# Altium project testrack_carrier.PrjPcb
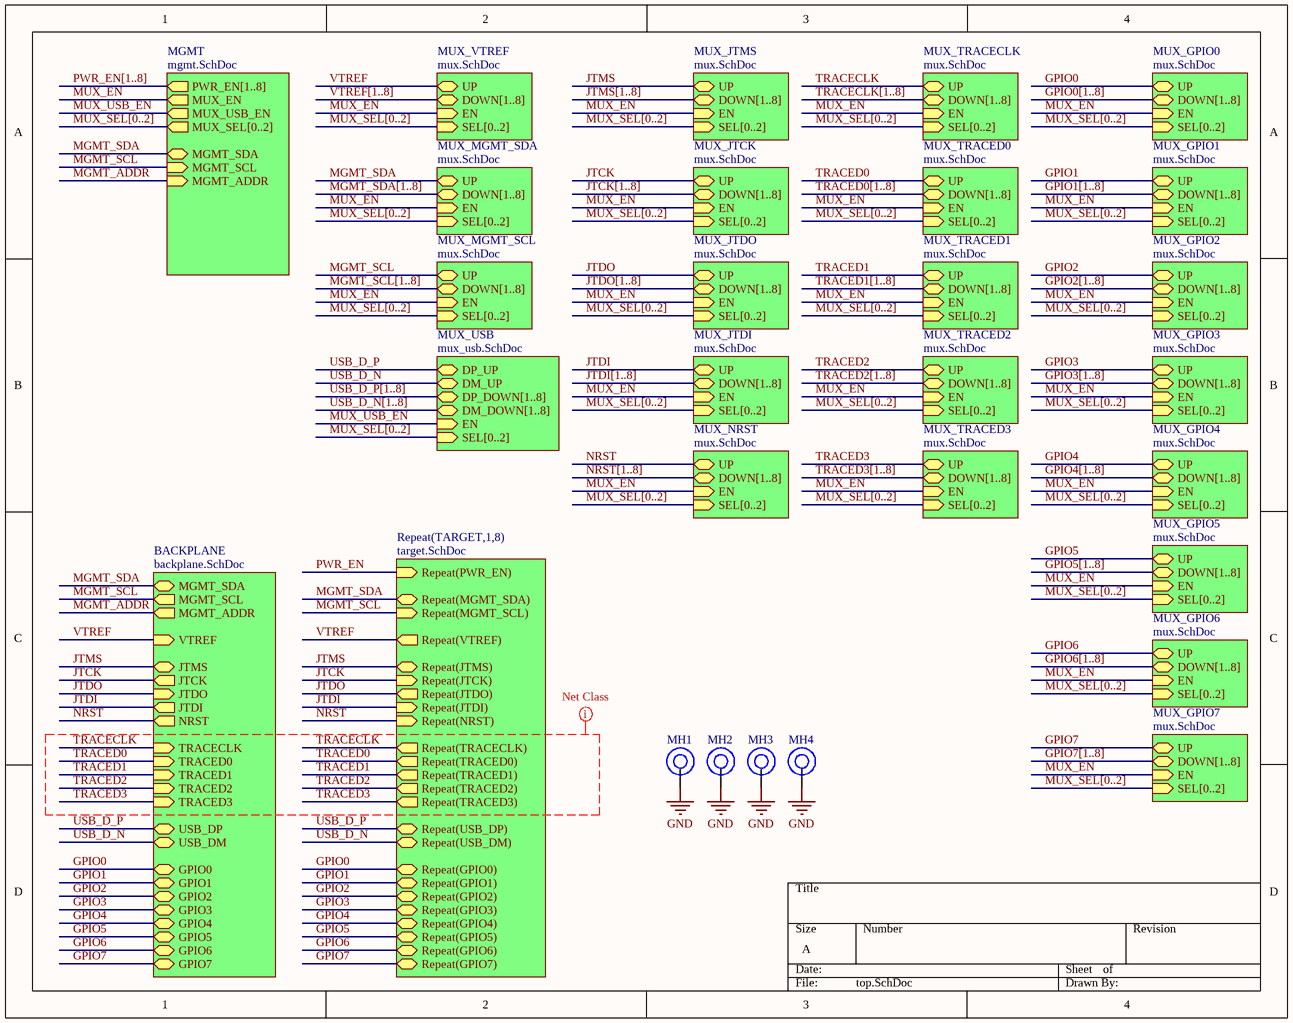
[diagram p0: top.SchDoc]
6 sheets, 115 parts. Net scope: hierarchical (ports join the sheet entries above them; power ports are global).
Board file: testrack_carrier.PcbDoc
Sheets:
  top.SchDoc
    TARGET1 = target.SchDoc
    TARGET2 = target.SchDoc
    TARGET3 = target.SchDoc
    TARGET4 = target.SchDoc
    TARGET5 = target.SchDoc
    TARGET6 = target.SchDoc
    TARGET7 = target.SchDoc
    TARGET8 = target.SchDoc
    BACKPLANE = backplane.SchDoc
    MGMT = mgmt.SchDoc
    MUX_VTREF = mux.SchDoc
    MUX_JTMS = mux.SchDoc
    MUX_GPIO0 = mux.SchDoc
    MUX_GPIO1 = mux.SchDoc
    MUX_GPIO2 = mux.SchDoc
    MUX_GPIO3 = mux.SchDoc
    MUX_GPIO4 = mux.SchDoc
    MUX_GPIO5 = mux.SchDoc
    MUX_GPIO6 = mux.SchDoc
    MUX_GPIO7 = mux.SchDoc
    MUX_TRACECLK = mux.SchDoc
    MUX_TRACED0 = mux.SchDoc
    MUX_TRACED1 = mux.SchDoc
    MUX_TRACED2 = mux.SchDoc
    MUX_TRACED3 = mux.SchDoc
    MUX_JTCK = mux.SchDoc
    MUX_JTDO = mux.SchDoc
    MUX_JTDI = mux.SchDoc
    MUX_NRST = mux.SchDoc
    MUX_USB = mux_usb.SchDoc
    MUX_MGMT_SDA = mux.SchDoc
    MUX_MGMT_SCL = mux.SchDoc

## Sheet top.SchDoc
size A

### Parts
MH1  Mounting_Hole  [WA-SMSI_M2.5]  (value not drawn)
MH2  Mounting_Hole  [WA-SMSI_M2.5]  (value not drawn)
MH3  Mounting_Hole  [WA-SMSI_M2.5]  (value not drawn)
MH4  Mounting_Hole  [WA-SMSI_M2.5]  (value not drawn)

### Sub-sheets
BACKPLANE = backplane.SchDoc: JTCK (out), GPIO1 (bidir), GPIO0 (bidir), TRACED0 (in), GPIO6 (bidir), USB_DP (bidir), NRST (out), USB_DM (bidir), MGMT_SDA (bidir), GPIO5 (bidir), JTDO (in), GPIO7 (bidir), GPIO3 (bidir), VTREF (in), TRACED2 (in), GPIO2 (bidir), TRACECLK (in), GPIO4 (bidir), MGMT_SCL (out), JTMS (bidir), TRACED3 (in), TRACED1 (in), JTDI (out), MGMT_ADDR (out)
MGMT = mgmt.SchDoc: PWR_EN[1..8] (out), MUX_SEL[0..2] (out), MGMT_SDA (bidir), MGMT_SCL (in), MUX_EN (out), MGMT_ADDR (in), MUX_USB_EN (out)
MUX_GPIO0 = mux.SchDoc: SEL[0..2] (in), DOWN[1..8] (bidir), UP (bidir), EN (in)
MUX_GPIO1 = mux.SchDoc: SEL[0..2] (in), DOWN[1..8] (bidir), UP (bidir), EN (in)
MUX_GPIO2 = mux.SchDoc: SEL[0..2] (in), DOWN[1..8] (bidir), UP (bidir), EN (in)
MUX_GPIO3 = mux.SchDoc: SEL[0..2] (in), DOWN[1..8] (bidir), UP (bidir), EN (in)
MUX_GPIO4 = mux.SchDoc: SEL[0..2] (in), DOWN[1..8] (bidir), UP (bidir), EN (in)
MUX_GPIO5 = mux.SchDoc: SEL[0..2] (in), DOWN[1..8] (bidir), UP (bidir), EN (in)
MUX_GPIO6 = mux.SchDoc: SEL[0..2] (in), DOWN[1..8] (bidir), UP (bidir), EN (in)
MUX_GPIO7 = mux.SchDoc: SEL[0..2] (in), DOWN[1..8] (bidir), UP (bidir), EN (in)
MUX_JTCK = mux.SchDoc: SEL[0..2] (in), DOWN[1..8] (bidir), UP (bidir), EN (in)
MUX_JTDI = mux.SchDoc: SEL[0..2] (in), DOWN[1..8] (bidir), UP (bidir), EN (in)
MUX_JTDO = mux.SchDoc: SEL[0..2] (in), DOWN[1..8] (bidir), UP (bidir), EN (in)
MUX_JTMS = mux.SchDoc: SEL[0..2] (in), DOWN[1..8] (bidir), UP (bidir), EN (in)
MUX_MGMT_SCL = mux.SchDoc: SEL[0..2] (in), DOWN[1..8] (bidir), UP (bidir), EN (in)
MUX_MGMT_SDA = mux.SchDoc: SEL[0..2] (in), DOWN[1..8] (bidir), UP (bidir), EN (in)
MUX_NRST = mux.SchDoc: SEL[0..2] (in), DOWN[1..8] (bidir), UP (bidir), EN (in)
MUX_TRACECLK = mux.SchDoc: SEL[0..2] (in), DOWN[1..8] (bidir), UP (bidir), EN (in)
MUX_TRACED0 = mux.SchDoc: SEL[0..2] (in), DOWN[1..8] (bidir), UP (bidir), EN (in)
MUX_TRACED1 = mux.SchDoc: SEL[0..2] (in), DOWN[1..8] (bidir), UP (bidir), EN (in)
MUX_TRACED2 = mux.SchDoc: SEL[0..2] (in), DOWN[1..8] (bidir), UP (bidir), EN (in)
MUX_TRACED3 = mux.SchDoc: SEL[0..2] (in), DOWN[1..8] (bidir), UP (bidir), EN (in)
MUX_USB = mux_usb.SchDoc: SEL[0..2] (in), DP_UP (bidir), EN (in), DP_DOWN[1..8] (bidir), DM_UP (bidir), DM_DOWN[1..8] (bidir)
MUX_VTREF = mux.SchDoc: SEL[0..2] (in), DOWN[1..8] (bidir), UP (bidir), EN (in)
Repeat(TARGET,1,8) = target.SchDoc: Repeat(JTCK) (in), Repeat(GPIO1) (bidir), Repeat(GPIO0) (bidir), Repeat(TRACED0) (out), Repeat(GPIO6) (bidir), Repeat(USB_DP) (bidir), Repeat(NRST) (in), Repeat(USB_DM) (bidir), Repeat(MGMT_SDA) (bidir), Repeat(GPIO5) (bidir), Repeat(JTDO) (out), Repeat(GPIO7) (bidir), Repeat(GPIO3) (bidir), Repeat(VTREF) (out), Repeat(TRACED2) (out), Repeat(GPIO2) (bidir), Repeat(TRACECLK) (out), Repeat(GPIO4) (bidir), Repeat(MGMT_SCL) (in), Repeat(JTMS) (bidir), Repeat(TRACED3) (out), Repeat(TRACED1) (out), Repeat(JTDI) (in), Repeat(PWR_EN) (in)

### Nets
GND: MH1.1 MH2.1 MH3.1 MH4.1
GPIO0: sheet Repeat(TARGET,1,8)/Repeat(GPIO0), sheet BACKPLANE/GPIO0, sheet MUX_GPIO0/UP
GPIO1: sheet Repeat(TARGET,1,8)/Repeat(GPIO1), sheet BACKPLANE/GPIO1, sheet MUX_GPIO1/UP
GPIO2: sheet Repeat(TARGET,1,8)/Repeat(GPIO2), sheet BACKPLANE/GPIO2, sheet MUX_GPIO2/UP
GPIO3: sheet Repeat(TARGET,1,8)/Repeat(GPIO3), sheet BACKPLANE/GPIO3, sheet MUX_GPIO3/UP
GPIO4: sheet Repeat(TARGET,1,8)/Repeat(GPIO4), sheet BACKPLANE/GPIO4, sheet MUX_GPIO4/UP
GPIO5: sheet Repeat(TARGET,1,8)/Repeat(GPIO5), sheet BACKPLANE/GPIO5, sheet MUX_GPIO5/UP
GPIO6: sheet Repeat(TARGET,1,8)/Repeat(GPIO6), sheet BACKPLANE/GPIO6, sheet MUX_GPIO6/UP
GPIO7: sheet Repeat(TARGET,1,8)/Repeat(GPIO7), sheet BACKPLANE/GPIO7, sheet MUX_GPIO7/UP
JTCK: sheet Repeat(TARGET,1,8)/Repeat(JTCK), sheet BACKPLANE/JTCK, sheet MUX_JTCK/UP
JTDI: sheet Repeat(TARGET,1,8)/Repeat(JTDI), sheet BACKPLANE/JTDI, sheet MUX_JTDI/UP
JTDO: sheet Repeat(TARGET,1,8)/Repeat(JTDO), sheet BACKPLANE/JTDO, sheet MUX_JTDO/UP
JTMS: sheet Repeat(TARGET,1,8)/Repeat(JTMS), sheet BACKPLANE/JTMS, sheet MUX_JTMS/UP
MGMT_ADDR: sheet BACKPLANE/MGMT_ADDR, sheet MGMT/MGMT_ADDR
MGMT_SCL: sheet Repeat(TARGET,1,8)/Repeat(MGMT_SCL), sheet BACKPLANE/MGMT_SCL, sheet MGMT/MGMT_SCL, sheet MUX_MGMT_SCL/UP
MGMT_SDA: sheet Repeat(TARGET,1,8)/Repeat(MGMT_SDA), sheet BACKPLANE/MGMT_SDA, sheet MGMT/MGMT_SDA, sheet MUX_MGMT_SDA/UP
MUX_EN: sheet MGMT/MUX_EN, sheet MUX_VTREF/EN, sheet MUX_JTMS/EN, sheet MUX_GPIO0/EN, sheet MUX_GPIO1/EN, sheet MUX_GPIO2/EN, sheet MUX_GPIO3/EN, sheet MUX_GPIO4/EN, sheet MUX_GPIO5/EN, sheet MUX_GPIO6/EN, sheet MUX_GPIO7/EN, sheet MUX_TRACECLK/EN, sheet MUX_TRACED0/EN, sheet MUX_TRACED1/EN, sheet MUX_TRACED2/EN, sheet MUX_TRACED3/EN, sheet MUX_JTCK/EN, sheet MUX_JTDO/EN, sheet MUX_JTDI/EN, sheet MUX_NRST/EN, sheet MUX_MGMT_SDA/EN, sheet MUX_MGMT_SCL/EN
MUX_USB_EN: sheet MGMT/MUX_USB_EN, sheet MUX_USB/EN
NRST: sheet Repeat(TARGET,1,8)/Repeat(NRST), sheet BACKPLANE/NRST, sheet MUX_NRST/UP
PWR_EN: sheet Repeat(TARGET,1,8)/Repeat(PWR_EN)
TRACECLK: sheet Repeat(TARGET,1,8)/Repeat(TRACECLK), sheet BACKPLANE/TRACECLK, sheet MUX_TRACECLK/UP
TRACED0: sheet Repeat(TARGET,1,8)/Repeat(TRACED0), sheet BACKPLANE/TRACED0, sheet MUX_TRACED0/UP
TRACED1: sheet Repeat(TARGET,1,8)/Repeat(TRACED1), sheet BACKPLANE/TRACED1, sheet MUX_TRACED1/UP
TRACED2: sheet Repeat(TARGET,1,8)/Repeat(TRACED2), sheet BACKPLANE/TRACED2, sheet MUX_TRACED2/UP
TRACED3: sheet Repeat(TARGET,1,8)/Repeat(TRACED3), sheet BACKPLANE/TRACED3, sheet MUX_TRACED3/UP
USB_D_N: sheet Repeat(TARGET,1,8)/Repeat(USB_DM), sheet BACKPLANE/USB_DM, sheet MUX_USB/DM_UP
USB_D_P: sheet Repeat(TARGET,1,8)/Repeat(USB_DP), sheet BACKPLANE/USB_DP, sheet MUX_USB/DP_UP
VTREF: sheet Repeat(TARGET,1,8)/Repeat(VTREF), sheet BACKPLANE/VTREF, sheet MUX_VTREF/UP

### Buses and harness runs
bus GPIO0[1..8] = sheet MUX_GPIO0/DOWN[1..8]
bus GPIO1[1..8] = sheet MUX_GPIO1/DOWN[1..8]
bus GPIO2[1..8] = sheet MUX_GPIO2/DOWN[1..8]
bus GPIO3[1..8] = sheet MUX_GPIO3/DOWN[1..8]
bus GPIO4[1..8] = sheet MUX_GPIO4/DOWN[1..8]
bus GPIO5[1..8] = sheet MUX_GPIO5/DOWN[1..8]
bus GPIO6[1..8] = sheet MUX_GPIO6/DOWN[1..8]
bus GPIO7[1..8] = sheet MUX_GPIO7/DOWN[1..8]
bus JTCK[1..8] = sheet MUX_JTCK/DOWN[1..8]
bus JTDI[1..8] = sheet MUX_JTDI/DOWN[1..8]
bus JTDO[1..8] = sheet MUX_JTDO/DOWN[1..8]
bus JTMS[1..8] = sheet MUX_JTMS/DOWN[1..8]
bus MGMT_SCL[1..8] = sheet MUX_MGMT_SCL/DOWN[1..8]
bus MGMT_SDA[1..8] = sheet MUX_MGMT_SDA/DOWN[1..8]
bus MUX_SEL[0..2] = sheet MGMT/MUX_SEL[0..2]
bus MUX_SEL[0..2] = sheet MUX_GPIO0/SEL[0..2]
bus MUX_SEL[0..2] = sheet MUX_GPIO1/SEL[0..2]
bus MUX_SEL[0..2] = sheet MUX_GPIO2/SEL[0..2]
bus MUX_SEL[0..2] = sheet MUX_GPIO3/SEL[0..2]
bus MUX_SEL[0..2] = sheet MUX_GPIO4/SEL[0..2]
bus MUX_SEL[0..2] = sheet MUX_GPIO5/SEL[0..2]
bus MUX_SEL[0..2] = sheet MUX_GPIO6/SEL[0..2]
bus MUX_SEL[0..2] = sheet MUX_GPIO7/SEL[0..2]
bus MUX_SEL[0..2] = sheet MUX_JTCK/SEL[0..2]
bus MUX_SEL[0..2] = sheet MUX_JTDI/SEL[0..2]
bus MUX_SEL[0..2] = sheet MUX_JTDO/SEL[0..2]
bus MUX_SEL[0..2] = sheet MUX_JTMS/SEL[0..2]
bus MUX_SEL[0..2] = sheet MUX_MGMT_SCL/SEL[0..2]
bus MUX_SEL[0..2] = sheet MUX_MGMT_SDA/SEL[0..2]
bus MUX_SEL[0..2] = sheet MUX_NRST/SEL[0..2]
bus MUX_SEL[0..2] = sheet MUX_TRACECLK/SEL[0..2]
bus MUX_SEL[0..2] = sheet MUX_TRACED0/SEL[0..2]
bus MUX_SEL[0..2] = sheet MUX_TRACED1/SEL[0..2]
bus MUX_SEL[0..2] = sheet MUX_TRACED2/SEL[0..2]
bus MUX_SEL[0..2] = sheet MUX_TRACED3/SEL[0..2]
bus MUX_SEL[0..2] = sheet MUX_USB/SEL[0..2]
bus MUX_SEL[0..2] = sheet MUX_VTREF/SEL[0..2]
bus NRST[1..8] = sheet MUX_NRST/DOWN[1..8]
bus PWR_EN[1..8] = sheet MGMT/PWR_EN[1..8]
bus TRACECLK[1..8] = sheet MUX_TRACECLK/DOWN[1..8]
bus TRACED0[1..8] = sheet MUX_TRACED0/DOWN[1..8]
bus TRACED1[1..8] = sheet MUX_TRACED1/DOWN[1..8]
bus TRACED2[1..8] = sheet MUX_TRACED2/DOWN[1..8]
bus TRACED3[1..8] = sheet MUX_TRACED3/DOWN[1..8]
bus USB_D_N[1..8] = sheet MUX_USB/DM_DOWN[1..8]
bus USB_D_P[1..8] = sheet MUX_USB/DP_DOWN[1..8]
bus VTREF[1..8] = sheet MUX_VTREF/DOWN[1..8]

### Layout directives
net class TRACE: TRACECLK, TRACED0, TRACED1, TRACED2, TRACED3

## Sheet target.SchDoc
size A
Used 8 times, as channels TARGET1, TARGET2, TARGET3, TARGET4, TARGET5, TARGET6, TARGET7, TARGET8. Parts and nets are listed once, with the designators drawn on the sheet.
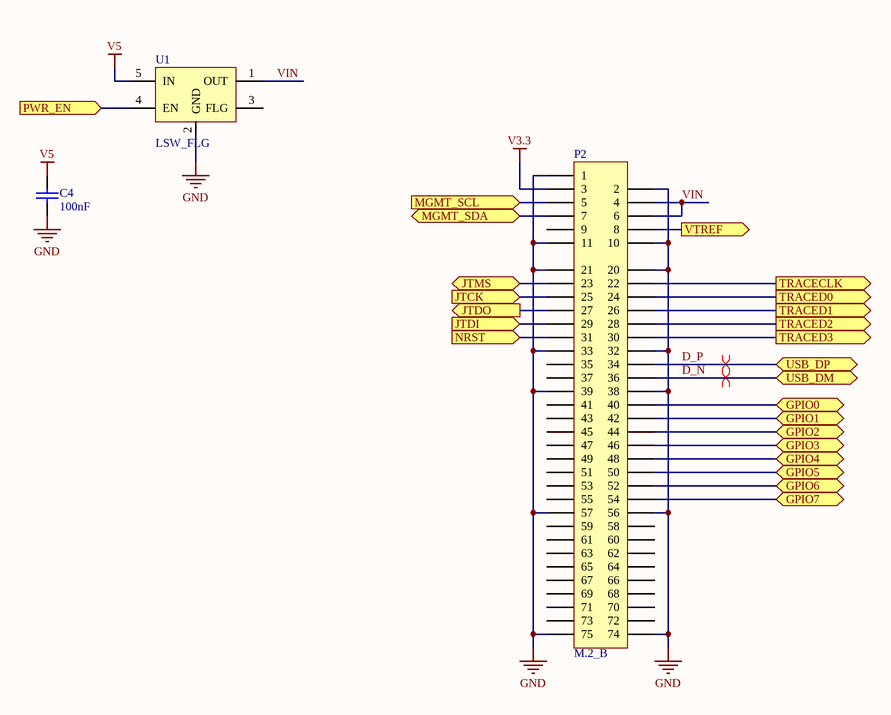
[diagram p1: target.SchDoc]

### Parts
C4  100nF  [0402]
P2  M.2_B  [M.2_B]
U1  LSW_FLG  [SOT23-5]

### Ports
GPIO0 (bidir), GPIO1 (bidir), GPIO2 (bidir), GPIO3 (bidir), GPIO4 (bidir), GPIO5 (bidir), GPIO6 (bidir), GPIO7 (bidir), JTCK (in), JTDI (in), JTDO (out), JTMS (bidir), MGMT_SCL (in), MGMT_SDA (bidir), NRST (in), PWR_EN (in), TRACECLK (out), TRACED0 (out), TRACED1 (out), TRACED2 (out), TRACED3 (out), USB_DM (bidir), USB_DP (bidir), VTREF (out)

### Nets
GND: C4.1 P2.1 P2.2 P2.10 P2.11 P2.20 P2.21 P2.32 P2.33 P2.38 P2.39 P2.56 P2.57 P2.74 P2.75 U1.2(GND)
V3.3: P2.3
V5: C4.2 U1.5(IN)
D_N: P2.36 ; port USB_DM
D_P: P2.34 ; port USB_DP
GPIO0: P2.40 ; port GPIO0
GPIO1: P2.42 ; port GPIO1
GPIO2: P2.44 ; port GPIO2
GPIO3: P2.46 ; port GPIO3
GPIO4: P2.48 ; port GPIO4
GPIO5: P2.50 ; port GPIO5
GPIO6: P2.52 ; port GPIO6
GPIO7: P2.54 ; port GPIO7
JTCK: P2.25 ; port JTCK
JTDI: P2.29 ; port JTDI
JTDO: P2.27 ; port JTDO
JTMS: P2.23 ; port JTMS
MGMT_SCL: P2.5 ; port MGMT_SCL
MGMT_SDA: P2.7 ; port MGMT_SDA
NRST: P2.31 ; port NRST
PWR_EN: U1.4(EN) ; port PWR_EN
TRACECLK: P2.22 ; port TRACECLK
TRACED0: P2.24 ; port TRACED0
TRACED1: P2.26 ; port TRACED1
TRACED2: P2.28 ; port TRACED2
TRACED3: P2.30 ; port TRACED3
VIN: P2.4 P2.6 U1.1(OUT)
VTREF: P2.8 ; port VTREF

Not connected (* = marked no-connect by the designer): P2 9 35 37 41 43 45 47 49 51 53 55 58 59 60 61 62 63 64 65 66 67 68 69 70 71 72 73; U1 3(FLG)

### Channels
TARGET1: designators end in _TARGET1; ports GPIO0=GPIO01 GPIO1=GPIO11 GPIO2=GPIO21 GPIO3=GPIO31 GPIO4=GPIO41 GPIO5=GPIO51 GPIO6=GPIO61 GPIO7=GPIO71 JTCK=JTCK1 JTDI=JTDI1 JTDO=JTDO1 JTMS=JTMS1 MGMT_SCL=MGMT_SCL1 MGMT_SDA=MGMT_SDA1 NRST=NRST1 PWR_EN=PWR_EN1 TRACECLK=TRACECLK1 TRACED0=TRACED01 TRACED1=TRACED11 TRACED2=TRACED21 TRACED3=TRACED31 USB_DM=USB_D_N1 USB_DP=USB_D_P1 VTREF=VTREF1
TARGET2: designators end in _TARGET2; ports GPIO0=GPIO02 GPIO1=GPIO12 GPIO2=GPIO22 GPIO3=GPIO32 GPIO4=GPIO42 GPIO5=GPIO52 GPIO6=GPIO62 GPIO7=GPIO72 JTCK=JTCK2 JTDI=JTDI2 JTDO=JTDO2 JTMS=JTMS2 MGMT_SCL=MGMT_SCL2 MGMT_SDA=MGMT_SDA2 NRST=NRST2 PWR_EN=PWR_EN2 TRACECLK=TRACECLK2 TRACED0=TRACED02 TRACED1=TRACED12 TRACED2=TRACED22 TRACED3=TRACED32 USB_DM=USB_D_N2 USB_DP=USB_D_P2 VTREF=VTREF2
TARGET3: designators end in _TARGET3; ports GPIO0=GPIO03 GPIO1=GPIO13 GPIO2=GPIO23 GPIO3=GPIO33 GPIO4=GPIO43 GPIO5=GPIO53 GPIO6=GPIO63 GPIO7=GPIO73 JTCK=JTCK3 JTDI=JTDI3 JTDO=JTDO3 JTMS=JTMS3 MGMT_SCL=MGMT_SCL3 MGMT_SDA=MGMT_SDA3 NRST=NRST3 PWR_EN=PWR_EN3 TRACECLK=TRACECLK3 TRACED0=TRACED03 TRACED1=TRACED13 TRACED2=TRACED23 TRACED3=TRACED33 USB_DM=USB_D_N3 USB_DP=USB_D_P3 VTREF=VTREF3
TARGET4: designators end in _TARGET4; ports GPIO0=GPIO04 GPIO1=GPIO14 GPIO2=GPIO24 GPIO3=GPIO34 GPIO4=GPIO44 GPIO5=GPIO54 GPIO6=GPIO64 GPIO7=GPIO74 JTCK=JTCK4 JTDI=JTDI4 JTDO=JTDO4 JTMS=JTMS4 MGMT_SCL=MGMT_SCL4 MGMT_SDA=MGMT_SDA4 NRST=NRST4 PWR_EN=PWR_EN4 TRACECLK=TRACECLK4 TRACED0=TRACED04 TRACED1=TRACED14 TRACED2=TRACED24 TRACED3=TRACED34 USB_DM=USB_D_N4 USB_DP=USB_D_P4 VTREF=VTREF4
TARGET5: designators end in _TARGET5; ports GPIO0=GPIO05 GPIO1=GPIO15 GPIO2=GPIO25 GPIO3=GPIO35 GPIO4=GPIO45 GPIO5=GPIO55 GPIO6=GPIO65 GPIO7=GPIO75 JTCK=JTCK5 JTDI=JTDI5 JTDO=JTDO5 JTMS=JTMS5 MGMT_SCL=MGMT_SCL5 MGMT_SDA=MGMT_SDA5 NRST=NRST5 PWR_EN=PWR_EN5 TRACECLK=TRACECLK5 TRACED0=TRACED05 TRACED1=TRACED15 TRACED2=TRACED25 TRACED3=TRACED35 USB_DM=USB_D_N5 USB_DP=USB_D_P5 VTREF=VTREF5
TARGET6: designators end in _TARGET6; ports GPIO0=GPIO06 GPIO1=GPIO16 GPIO2=GPIO26 GPIO3=GPIO36 GPIO4=GPIO46 GPIO5=GPIO56 GPIO6=GPIO66 GPIO7=GPIO76 JTCK=JTCK6 JTDI=JTDI6 JTDO=JTDO6 JTMS=JTMS6 MGMT_SCL=MGMT_SCL6 MGMT_SDA=MGMT_SDA6 NRST=NRST6 PWR_EN=PWR_EN6 TRACECLK=TRACECLK6 TRACED0=TRACED06 TRACED1=TRACED16 TRACED2=TRACED26 TRACED3=TRACED36 USB_DM=USB_D_N6 USB_DP=USB_D_P6 VTREF=VTREF6
TARGET7: designators end in _TARGET7; ports GPIO0=GPIO07 GPIO1=GPIO17 GPIO2=GPIO27 GPIO3=GPIO37 GPIO4=GPIO47 GPIO5=GPIO57 GPIO6=GPIO67 GPIO7=GPIO77 JTCK=JTCK7 JTDI=JTDI7 JTDO=JTDO7 JTMS=JTMS7 MGMT_SCL=MGMT_SCL7 MGMT_SDA=MGMT_SDA7 NRST=NRST7 PWR_EN=PWR_EN7 TRACECLK=TRACECLK7 TRACED0=TRACED07 TRACED1=TRACED17 TRACED2=TRACED27 TRACED3=TRACED37 USB_DM=USB_D_N7 USB_DP=USB_D_P7 VTREF=VTREF7
TARGET8: designators end in _TARGET8; ports GPIO0=GPIO08 GPIO1=GPIO18 GPIO2=GPIO28 GPIO3=GPIO38 GPIO4=GPIO48 GPIO5=GPIO58 GPIO6=GPIO68 GPIO7=GPIO78 JTCK=JTCK8 JTDI=JTDI8 JTDO=JTDO8 JTMS=JTMS8 MGMT_SCL=MGMT_SCL8 MGMT_SDA=MGMT_SDA8 NRST=NRST8 PWR_EN=PWR_EN8 TRACECLK=TRACECLK8 TRACED0=TRACED08 TRACED1=TRACED18 TRACED2=TRACED28 TRACED3=TRACED38 USB_DM=USB_D_N8 USB_DP=USB_D_P8 VTREF=VTREF8

### Layout directives
differential pair: USB_D_N1, USB_D_P1

### Library data of the parts
C4 = Capacitor: Value: 100nF

## Sheet backplane.SchDoc
size A
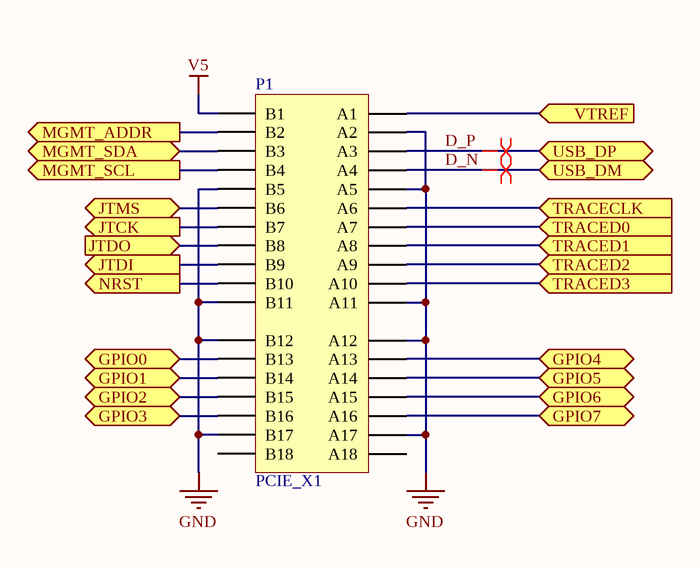
[diagram p2: backplane.SchDoc]

### Parts
P1  PCIE_X1  [PCIE_X1_EDGE]

### Ports
GPIO0 (bidir), GPIO1 (bidir), GPIO2 (bidir), GPIO3 (bidir), GPIO4 (bidir), GPIO5 (bidir), GPIO6 (bidir), GPIO7 (bidir), JTCK (out), JTDI (out), JTDO (in), JTMS (bidir), MGMT_ADDR (out), MGMT_SCL (out), MGMT_SDA (bidir), NRST (out), TRACECLK (in), TRACED0 (in), TRACED1 (in), TRACED2 (in), TRACED3 (in), USB_DM (bidir), USB_DP (bidir), VTREF (in)

### Nets
GND: P1.A2 P1.A5 P1.A11 P1.A12 P1.A17 P1.B5 P1.B11 P1.B12 P1.B17
V5: P1.B1
D_N: P1.A4 ; port USB_DM  [project net USB_D_N]
D_P: P1.A3 ; port USB_DP  [project net USB_D_P]
GPIO0: P1.B13 ; port GPIO0
GPIO1: P1.B14 ; port GPIO1
GPIO2: P1.B15 ; port GPIO2
GPIO3: P1.B16 ; port GPIO3
GPIO4: P1.A13 ; port GPIO4
GPIO5: P1.A14 ; port GPIO5
GPIO6: P1.A15 ; port GPIO6
GPIO7: P1.A16 ; port GPIO7
JTCK: P1.B7 ; port JTCK
JTDI: P1.B9 ; port JTDI
JTDO: P1.B8 ; port JTDO
JTMS: P1.B6 ; port JTMS
MGMT_ADDR: P1.B2 ; port MGMT_ADDR
MGMT_SCL: P1.B4 ; port MGMT_SCL
MGMT_SDA: P1.B3 ; port MGMT_SDA
NRST: P1.B10 ; port NRST
TRACECLK: P1.A6 ; port TRACECLK
TRACED0: P1.A7 ; port TRACED0
TRACED1: P1.A8 ; port TRACED1
TRACED2: P1.A9 ; port TRACED2
TRACED3: P1.A10 ; port TRACED3
VTREF: P1.A1 ; port VTREF

Not connected (* = marked no-connect by the designer): P1 A18 B18

### Layout directives
differential pair: USB_D_N, USB_D_P

## Sheet mgmt.SchDoc
size A
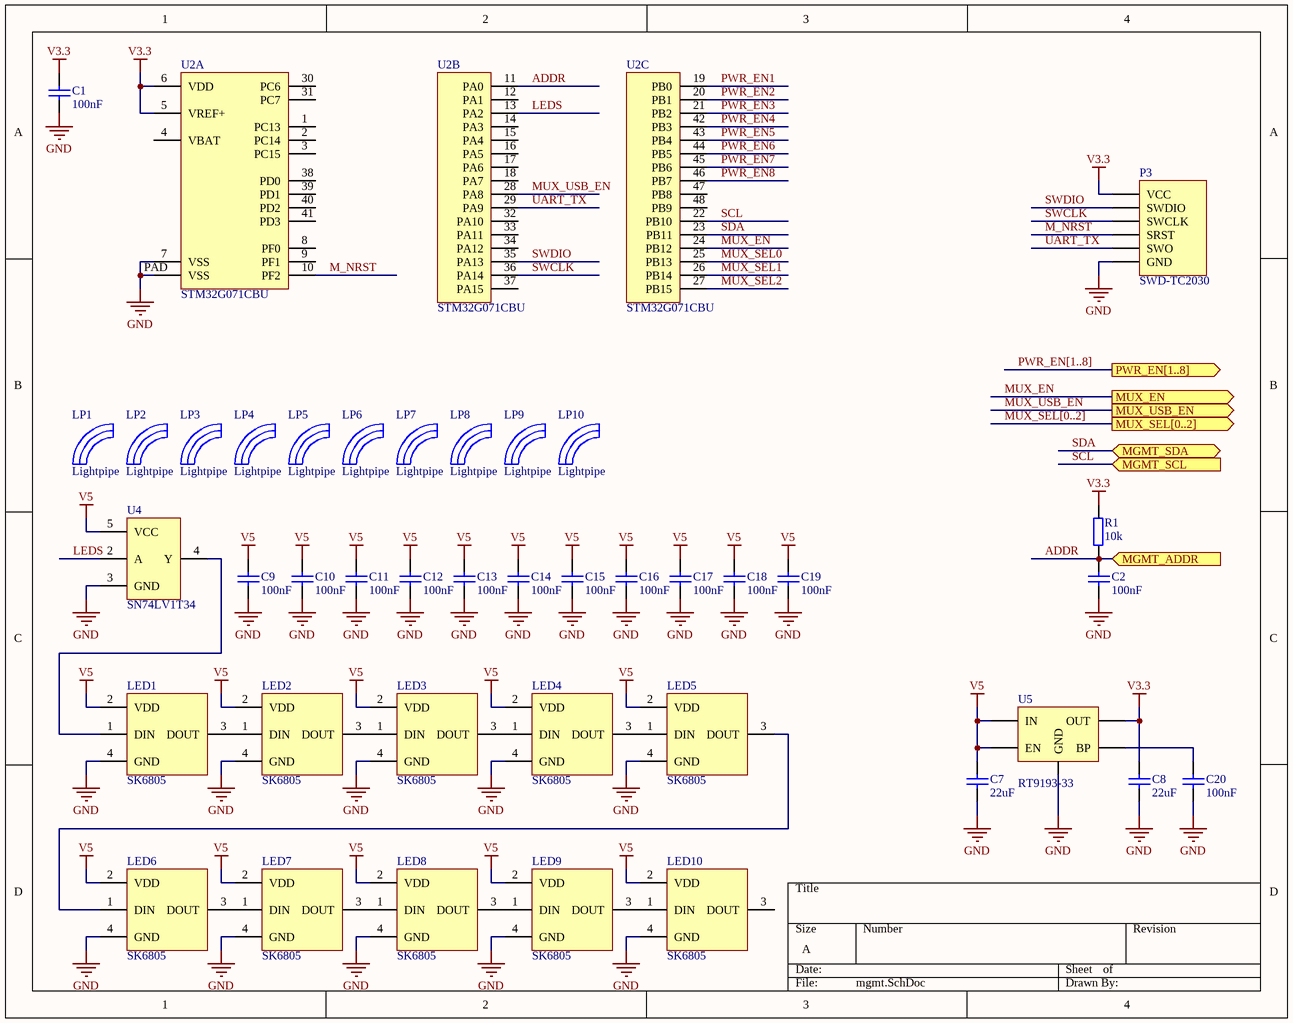
[diagram p3: mgmt.SchDoc]

### Parts
C1  100nF  [0402]
C2  100nF  [0402]
C7  22uF  [0805]
C8  22uF  [0805]
C9  100nF  [0402]
C10  100nF  [0402]
C11  100nF  [0402]
C12  100nF  [0402]
C13  100nF  [0402]
C14  100nF  [0402]
C15  100nF  [0402]
C16  100nF  [0402]
C17  100nF  [0402]
C18  100nF  [0402]
C19  100nF  [0402]
C20  100nF  [0402]
LED1  SK6805  [EC15]
LED2  SK6805  [EC15]
LED3  SK6805  [EC15]
LED4  SK6805  [EC15]
LED5  SK6805  [EC15]
LED6  SK6805  [EC15]
LED7  SK6805  [EC15]
LED8  SK6805  [EC15]
LED9  SK6805  [EC15]
LED10  SK6805  [EC15]
LP1  Lightpipe  [SLP3-150-100-F]
LP2  Lightpipe  [SLP3-150-100-F]
LP3  Lightpipe  [SLP3-150-100-F]
LP4  Lightpipe  [SLP3-150-100-F]
LP5  Lightpipe  [SLP3-150-100-F]
LP6  Lightpipe  [SLP3-150-100-F]
LP7  Lightpipe  [SLP3-150-100-F]
LP8  Lightpipe  [SLP3-150-100-F]
LP9  Lightpipe  [SLP3-150-100-F]
LP10  Lightpipe  [SLP3-150-100-F]
P3  SWD-TC2030  [TC2030-NL]
R1  10k  [0402]
U2  STM32G071CBU  [QFN50P690X710X60_HS-49N]  (parts A,B,C of 3)
U4  SN74LV1T34  [SOT23-5]
U5  RT9193-33  [SOT23-5]

### Ports
MGMT_ADDR (in), MGMT_SCL (in), MGMT_SDA (bidir), MUX_EN (out), MUX_SEL[0..2] (out), MUX_USB_EN (out), PWR_EN[1..8] (out)

### Nets
GND: C1.1 C2.1 C7.1 C8.1 C9.1 C10.1 C11.1 C12.1 C13.1 C14.1 C15.1 C16.1 C17.1 C18.1 C19.1 C20.1 LED1.4(GND) LED2.4(GND) LED3.4(GND) LED4.4(GND) LED5.4(GND) LED6.4(GND) LED7.4(GND) LED8.4(GND) LED9.4(GND) LED10.4(GND) P3.GND U2.7(VSS) U2.PAD(VSS) U4.3(GND) U5.GND
V3.3: C1.2 C8.2 P3.VCC R1.2 U2.5(VREF+) U2.6(VDD) U5.OUT
V5: C7.2 C9.2 C10.2 C11.2 C12.2 C13.2 C14.2 C15.2 C16.2 C17.2 C18.2 C19.2 LED1.2(VDD) LED2.2(VDD) LED3.2(VDD) LED4.2(VDD) LED5.2(VDD) LED6.2(VDD) LED7.2(VDD) LED8.2(VDD) LED9.2(VDD) LED10.2(VDD) U4.5(VCC) U5.EN U5.IN
ADDR: C2.2 R1.1 U2.11(PA0) ; port MGMT_ADDR  [project net MGMT_ADDR]
LEDS: U2.13(PA2) U4.2(A)
M_NRST: P3.SRST U2.10(PF2)
MUX_EN: U2.24(PB12) ; port MUX_EN
MUX_SEL0: U2.25(PB13)
MUX_SEL1: U2.26(PB14)
MUX_SEL2: U2.27(PB15)
MUX_USB_EN: U2.28(PA8) ; port MUX_USB_EN
PWR_EN1: U2.19(PB0)
PWR_EN2: U2.20(PB1)
PWR_EN3: U2.21(PB2)
PWR_EN4: U2.42(PB3)
PWR_EN5: U2.43(PB4)
PWR_EN6: U2.44(PB5)
PWR_EN7: U2.45(PB6)
PWR_EN8: U2.46(PB7)
SCL: U2.22(PB10) ; port MGMT_SCL  [project net MGMT_SCL]
SDA: U2.23(PB11) ; port MGMT_SDA  [project net MGMT_SDA]
SWCLK: P3.SWCLK U2.36(PA14)
SWDIO: P3.SWDIO U2.35(PA13)
UART_TX: P3.SWO U2.29(PA9)
NetC20_2: C20.2 U5.BP
NetLED1_1: LED1.1(DIN) U4.4(Y)
NetLED1_3: LED1.3(DOUT) LED2.1(DIN)
NetLED2_3: LED2.3(DOUT) LED3.1(DIN)
NetLED3_3: LED3.3(DOUT) LED4.1(DIN)
NetLED4_3: LED4.3(DOUT) LED5.1(DIN)
NetLED5_3: LED5.3(DOUT) LED6.1(DIN)
NetLED6_3: LED6.3(DOUT) LED7.1(DIN)
NetLED7_3: LED7.3(DOUT) LED8.1(DIN)
NetLED8_3: LED8.3(DOUT) LED9.1(DIN)
NetLED9_3: LED9.3(DOUT) LED10.1(DIN)

Not connected (* = marked no-connect by the designer): LED10 3(DOUT); U2 1(PC13) 2(PC14) 3(PC15) 4(VBAT) 8(PF0) 9(PF1) 12(PA1) 14(PA3) 15(PA4) 16(PA5) 17(PA6) 18(PA7) 30(PC6) 31(PC7) 32(PA10) 33(PA11) 34(PA12) 37(PA15) 38(PD0) 39(PD1) 40(PD2) 41(PD3) 47(PB8) 48(PB9)

### Buses and harness runs
bus MUX_SEL[0..2] = port MUX_SEL[0..2]
bus PWR_EN[1..8] = port PWR_EN[1..8]

### Library data of the parts
C1 C2 C7-C20 = Capacitor
  C1 C2 C9-C20: Value: 100nF
  C7 C8: Value: 22uF
P3 = SWD-TC2030: pin to pad: GND>5 SRST>3 SWCLK>4 SWDIO>2 SWO>6 VCC>1
R1 = Resistor: Value: 10k
U2 = STM32G0B1CxU
U4 = SN74LV1T34: Single Power Supply Single Buffer GATE CMOS Logic Level Shifter
U5 = VREG_EN_BP: pin to pad: BP>4 EN>3 GND>2 IN>1 OUT>5

## Sheet mux.SchDoc
size A
Used 21 times, as channels MUX_VTREF, MUX_JTMS, MUX_GPIO0, MUX_GPIO1, MUX_GPIO2, MUX_GPIO3, MUX_GPIO4, MUX_GPIO5, MUX_GPIO6, MUX_GPIO7, MUX_TRACECLK, MUX_TRACED0, MUX_TRACED1, MUX_TRACED2, MUX_TRACED3, MUX_JTCK, MUX_JTDO, MUX_JTDI, MUX_NRST, MUX_MGMT_SDA, MUX_MGMT_SCL. Parts and nets are listed once, with the designators drawn on the sheet.
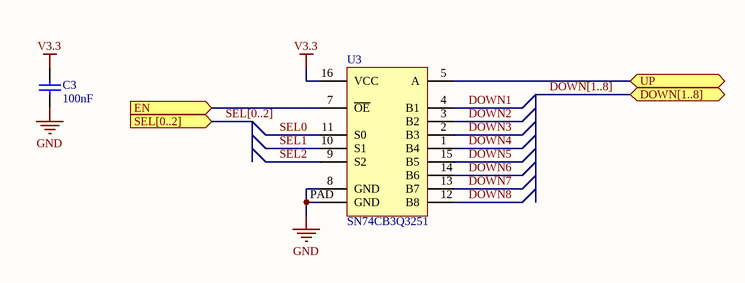
[diagram p4: mux.SchDoc]

### Parts
C3  100nF  [0402]
U3  SN74CB3Q3251  [TI_RGY]

### Ports
DOWN[1..8] (bidir), EN (in), SEL[0..2] (in), UP (bidir)

### Nets
GND: C3.1 U3.8(GND) U3.PAD(GND)
V3.3: C3.2 U3.16(VCC)
DOWN1: U3.4(B1)
DOWN2: U3.3(B2)
DOWN3: U3.2(B3)
DOWN4: U3.1(B4)
DOWN5: U3.15(B5)
DOWN6: U3.14(B6)
DOWN7: U3.13(B7)
DOWN8: U3.12(B8)
EN: U3.7(~{OE}) ; port EN
SEL0: U3.11(S0)
SEL1: U3.10(S1)
SEL2: U3.9(S2)
UP: U3.5(A) ; port UP

### Channels
MUX_VTREF: designators end in _MUX_VTREF; ports EN=MUX_EN UP=VTREF
MUX_JTMS: designators end in _MUX_JTMS; ports EN=MUX_EN UP=JTMS
MUX_GPIO0: designators end in _MUX_GPIO0; ports EN=MUX_EN UP=GPIO0
MUX_GPIO1: designators end in _MUX_GPIO1; ports EN=MUX_EN UP=GPIO1
MUX_GPIO2: designators end in _MUX_GPIO2; ports EN=MUX_EN UP=GPIO2
MUX_GPIO3: designators end in _MUX_GPIO3; ports EN=MUX_EN UP=GPIO3
MUX_GPIO4: designators end in _MUX_GPIO4; ports EN=MUX_EN UP=GPIO4
MUX_GPIO5: designators end in _MUX_GPIO5; ports EN=MUX_EN UP=GPIO5
MUX_GPIO6: designators end in _MUX_GPIO6; ports EN=MUX_EN UP=GPIO6
MUX_GPIO7: designators end in _MUX_GPIO7; ports EN=MUX_EN UP=GPIO7
MUX_TRACECLK: designators end in _MUX_TRACECLK; ports EN=MUX_EN UP=TRACECLK
MUX_TRACED0: designators end in _MUX_TRACED0; ports EN=MUX_EN UP=TRACED0
MUX_TRACED1: designators end in _MUX_TRACED1; ports EN=MUX_EN UP=TRACED1
MUX_TRACED2: designators end in _MUX_TRACED2; ports EN=MUX_EN UP=TRACED2
MUX_TRACED3: designators end in _MUX_TRACED3; ports EN=MUX_EN UP=TRACED3
MUX_JTCK: designators end in _MUX_JTCK; ports EN=MUX_EN UP=JTCK
MUX_JTDO: designators end in _MUX_JTDO; ports EN=MUX_EN UP=JTDO
MUX_JTDI: designators end in _MUX_JTDI; ports EN=MUX_EN UP=JTDI
MUX_NRST: designators end in _MUX_NRST; ports EN=MUX_EN UP=NRST
MUX_MGMT_SDA: designators end in _MUX_MGMT_SDA; ports EN=MUX_EN UP=MGMT_SDA
MUX_MGMT_SCL: designators end in _MUX_MGMT_SCL; ports EN=MUX_EN UP=MGMT_SCL

### Buses and harness runs
bus DOWN[1..8] = port DOWN[1..8]
bus SEL[0..2] = port SEL[0..2]

### Library data of the parts
C3 = Capacitor: Value: 100nF
U3 = SN74CB3Q3251: 1:8 Mux

## Sheet mux_usb.SchDoc
size A
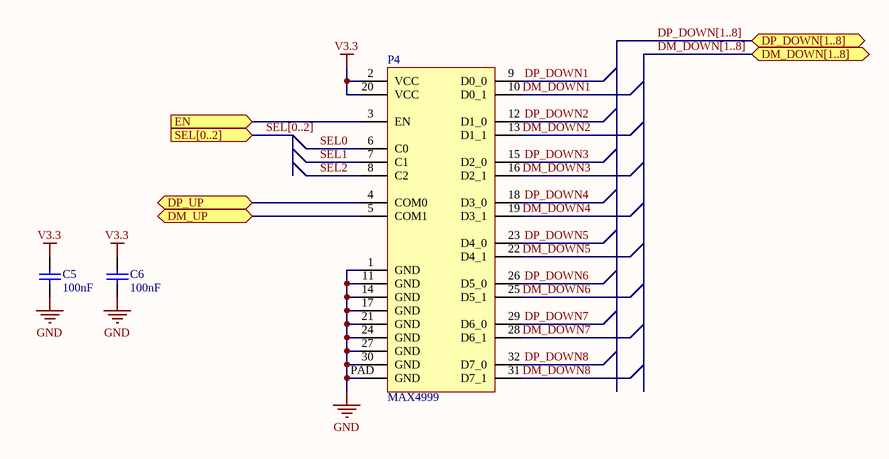
[diagram p5: mux_usb.SchDoc]

### Parts
C5  100nF  [0402]
C6  100nF  [0402]
P4  MAX4999  [MAXIM_T3255+4]

### Ports
DM_DOWN[1..8] (bidir), DM_UP (bidir), DP_DOWN[1..8] (bidir), DP_UP (bidir), EN (in), SEL[0..2] (in)

### Nets
GND: C5.1 C6.1 P4.1(GND) P4.11(GND) P4.14(GND) P4.17(GND) P4.21(GND) P4.24(GND) P4.27(GND) P4.30(GND) P4.PAD(GND)
V3.3: C5.2 C6.2 P4.2(VCC) P4.20(VCC)
DM_DOWN1: P4.10(D0_1)  [project net USB_D_N1]
DM_DOWN2: P4.13(D1_1)  [project net USB_D_N2]
DM_DOWN3: P4.16(D2_1)  [project net USB_D_N3]
DM_DOWN4: P4.19(D3_1)  [project net USB_D_N4]
DM_DOWN5: P4.22(D4_1)  [project net USB_D_N5]
DM_DOWN6: P4.25(D5_1)  [project net USB_D_N6]
DM_DOWN7: P4.28(D6_1)  [project net USB_D_N7]
DM_DOWN8: P4.31(D7_1)  [project net USB_D_N8]
DP_DOWN1: P4.9(D0_0)  [project net USB_D_P1]
DP_DOWN2: P4.12(D1_0)  [project net USB_D_P2]
DP_DOWN3: P4.15(D2_0)  [project net USB_D_P3]
DP_DOWN4: P4.18(D3_0)  [project net USB_D_P4]
DP_DOWN5: P4.23(D4_0)  [project net USB_D_P5]
DP_DOWN6: P4.26(D5_0)  [project net USB_D_P6]
DP_DOWN7: P4.29(D6_0)  [project net USB_D_P7]
DP_DOWN8: P4.32(D7_0)  [project net USB_D_P8]
MUX_USB_EN: P4.3(EN) ; port EN
SEL0: P4.6(C0)  [project net MUX_SEL0]
SEL1: P4.7(C1)  [project net MUX_SEL1]
SEL2: P4.8(C2)  [project net MUX_SEL2]
USB_D_N: P4.5(COM1) ; port DM_UP
USB_D_P: P4.4(COM0) ; port DP_UP

### Buses and harness runs
bus DM_DOWN[1..8] = port DM_DOWN[1..8]
bus DP_DOWN[1..8] = port DP_DOWN[1..8]
bus SEL[0..2] = port SEL[0..2]

### Library data of the parts
C5 C6 = Capacitor: Value: 100nF

## Nets that join several sheets
GND: top (MH1.1 MH2.1 MH3.1 MH4.1), TARGET1 (16 pins), TARGET2 (16 pins), TARGET3 (16 pins), TARGET4 (16 pins), TARGET5 (16 pins), TARGET6 (16 pins), TARGET7 (16 pins), TARGET8 (16 pins), backplane (9 pins), mgmt (31 pins), MUX_VTREF (C3_MUX_VTREF.1 U3_MUX_VTREF.8 U3_MUX_VTREF.PAD), MUX_JTMS (C3_MUX_JTMS.1 U3_MUX_JTMS.8 U3_MUX_JTMS.PAD), MUX_GPIO0 (C3_MUX_GPIO0.1 U3_MUX_GPIO0.8 U3_MUX_GPIO0.PAD), MUX_GPIO1 (C3_MUX_GPIO1.1 U3_MUX_GPIO1.8 U3_MUX_GPIO1.PAD), MUX_GPIO2 (C3_MUX_GPIO2.1 U3_MUX_GPIO2.8 U3_MUX_GPIO2.PAD), MUX_GPIO3 (C3_MUX_GPIO3.1 U3_MUX_GPIO3.8 U3_MUX_GPIO3.PAD), MUX_GPIO4 (C3_MUX_GPIO4.1 U3_MUX_GPIO4.8 U3_MUX_GPIO4.PAD), MUX_GPIO5 (C3_MUX_GPIO5.1 U3_MUX_GPIO5.8 U3_MUX_GPIO5.PAD), MUX_GPIO6 (C3_MUX_GPIO6.1 U3_MUX_GPIO6.8 U3_MUX_GPIO6.PAD), MUX_GPIO7 (C3_MUX_GPIO7.1 U3_MUX_GPIO7.8 U3_MUX_GPIO7.PAD), MUX_TRACECLK (C3_MUX_TRACECLK.1 U3_MUX_TRACECLK.8 U3_MUX_TRACECLK.PAD), MUX_TRACED0 (C3_MUX_TRACED0.1 U3_MUX_TRACED0.8 U3_MUX_TRACED0.PAD), MUX_TRACED1 (C3_MUX_TRACED1.1 U3_MUX_TRACED1.8 U3_MUX_TRACED1.PAD), MUX_TRACED2 (C3_MUX_TRACED2.1 U3_MUX_TRACED2.8 U3_MUX_TRACED2.PAD), MUX_TRACED3 (C3_MUX_TRACED3.1 U3_MUX_TRACED3.8 U3_MUX_TRACED3.PAD), MUX_JTCK (C3_MUX_JTCK.1 U3_MUX_JTCK.8 U3_MUX_JTCK.PAD), MUX_JTDO (C3_MUX_JTDO.1 U3_MUX_JTDO.8 U3_MUX_JTDO.PAD), MUX_JTDI (C3_MUX_JTDI.1 U3_MUX_JTDI.8 U3_MUX_JTDI.PAD), MUX_NRST (C3_MUX_NRST.1 U3_MUX_NRST.8 U3_MUX_NRST.PAD), mux_usb (11 pins), MUX_MGMT_SDA (C3_MUX_MGMT_SDA.1 U3_MUX_MGMT_SDA.8 U3_MUX_MGMT_SDA.PAD), MUX_MGMT_SCL (C3_MUX_MGMT_SCL.1 U3_MUX_MGMT_SCL.8 U3_MUX_MGMT_SCL.PAD)
V3.3: TARGET1 (P2_TARGET1.3), TARGET2 (P2_TARGET2.3), TARGET3 (P2_TARGET3.3), TARGET4 (P2_TARGET4.3), TARGET5 (P2_TARGET5.3), TARGET6 (P2_TARGET6.3), TARGET7 (P2_TARGET7.3), TARGET8 (P2_TARGET8.3), mgmt (7 pins), MUX_VTREF (C3_MUX_VTREF.2 U3_MUX_VTREF.16), MUX_JTMS (C3_MUX_JTMS.2 U3_MUX_JTMS.16), MUX_GPIO0 (C3_MUX_GPIO0.2 U3_MUX_GPIO0.16), MUX_GPIO1 (C3_MUX_GPIO1.2 U3_MUX_GPIO1.16), MUX_GPIO2 (C3_MUX_GPIO2.2 U3_MUX_GPIO2.16), MUX_GPIO3 (C3_MUX_GPIO3.2 U3_MUX_GPIO3.16), MUX_GPIO4 (C3_MUX_GPIO4.2 U3_MUX_GPIO4.16), MUX_GPIO5 (C3_MUX_GPIO5.2 U3_MUX_GPIO5.16), MUX_GPIO6 (C3_MUX_GPIO6.2 U3_MUX_GPIO6.16), MUX_GPIO7 (C3_MUX_GPIO7.2 U3_MUX_GPIO7.16), MUX_TRACECLK (C3_MUX_TRACECLK.2 U3_MUX_TRACECLK.16), MUX_TRACED0 (C3_MUX_TRACED0.2 U3_MUX_TRACED0.16), MUX_TRACED1 (C3_MUX_TRACED1.2 U3_MUX_TRACED1.16), MUX_TRACED2 (C3_MUX_TRACED2.2 U3_MUX_TRACED2.16), MUX_TRACED3 (C3_MUX_TRACED3.2 U3_MUX_TRACED3.16), MUX_JTCK (C3_MUX_JTCK.2 U3_MUX_JTCK.16), MUX_JTDO (C3_MUX_JTDO.2 U3_MUX_JTDO.16), MUX_JTDI (C3_MUX_JTDI.2 U3_MUX_JTDI.16), MUX_NRST (C3_MUX_NRST.2 U3_MUX_NRST.16), mux_usb (C5.2 C6.2 P4.2 P4.20), MUX_MGMT_SDA (C3_MUX_MGMT_SDA.2 U3_MUX_MGMT_SDA.16), MUX_MGMT_SCL (C3_MUX_MGMT_SCL.2 U3_MUX_MGMT_SCL.16)
V5: TARGET1 (C4_TARGET1.2 U1_TARGET1.5), TARGET2 (C4_TARGET2.2 U1_TARGET2.5), TARGET3 (C4_TARGET3.2 U1_TARGET3.5), TARGET4 (C4_TARGET4.2 U1_TARGET4.5), TARGET5 (C4_TARGET5.2 U1_TARGET5.5), TARGET6 (C4_TARGET6.2 U1_TARGET6.5), TARGET7 (C4_TARGET7.2 U1_TARGET7.5), TARGET8 (C4_TARGET8.2 U1_TARGET8.5), backplane (P1.B1), mgmt (25 pins)
GPIO0: backplane (P1.B13), MUX_GPIO0 (U3_MUX_GPIO0.5)
GPIO01: TARGET1 (P2_TARGET1.40), MUX_GPIO0 (U3_MUX_GPIO0.4)
GPIO1: backplane (P1.B14), MUX_GPIO1 (U3_MUX_GPIO1.5)
GPIO02: TARGET2 (P2_TARGET2.40), MUX_GPIO0 (U3_MUX_GPIO0.3)
GPIO2: backplane (P1.B15), MUX_GPIO2 (U3_MUX_GPIO2.5)
GPIO03: TARGET3 (P2_TARGET3.40), MUX_GPIO0 (U3_MUX_GPIO0.2)
GPIO3: backplane (P1.B16), MUX_GPIO3 (U3_MUX_GPIO3.5)
GPIO04: TARGET4 (P2_TARGET4.40), MUX_GPIO0 (U3_MUX_GPIO0.1)
GPIO4: backplane (P1.A13), MUX_GPIO4 (U3_MUX_GPIO4.5)
GPIO05: TARGET5 (P2_TARGET5.40), MUX_GPIO0 (U3_MUX_GPIO0.15)
GPIO5: backplane (P1.A14), MUX_GPIO5 (U3_MUX_GPIO5.5)
GPIO06: TARGET6 (P2_TARGET6.40), MUX_GPIO0 (U3_MUX_GPIO0.14)
GPIO6: backplane (P1.A15), MUX_GPIO6 (U3_MUX_GPIO6.5)
GPIO07: TARGET7 (P2_TARGET7.40), MUX_GPIO0 (U3_MUX_GPIO0.13)
GPIO7: backplane (P1.A16), MUX_GPIO7 (U3_MUX_GPIO7.5)
GPIO08: TARGET8 (P2_TARGET8.40), MUX_GPIO0 (U3_MUX_GPIO0.12)
GPIO11: TARGET1 (P2_TARGET1.42), MUX_GPIO1 (U3_MUX_GPIO1.4)
GPIO12: TARGET2 (P2_TARGET2.42), MUX_GPIO1 (U3_MUX_GPIO1.3)
GPIO13: TARGET3 (P2_TARGET3.42), MUX_GPIO1 (U3_MUX_GPIO1.2)
GPIO14: TARGET4 (P2_TARGET4.42), MUX_GPIO1 (U3_MUX_GPIO1.1)
GPIO15: TARGET5 (P2_TARGET5.42), MUX_GPIO1 (U3_MUX_GPIO1.15)
GPIO16: TARGET6 (P2_TARGET6.42), MUX_GPIO1 (U3_MUX_GPIO1.14)
GPIO17: TARGET7 (P2_TARGET7.42), MUX_GPIO1 (U3_MUX_GPIO1.13)
GPIO18: TARGET8 (P2_TARGET8.42), MUX_GPIO1 (U3_MUX_GPIO1.12)
GPIO21: TARGET1 (P2_TARGET1.44), MUX_GPIO2 (U3_MUX_GPIO2.4)
GPIO22: TARGET2 (P2_TARGET2.44), MUX_GPIO2 (U3_MUX_GPIO2.3)
GPIO23: TARGET3 (P2_TARGET3.44), MUX_GPIO2 (U3_MUX_GPIO2.2)
GPIO24: TARGET4 (P2_TARGET4.44), MUX_GPIO2 (U3_MUX_GPIO2.1)
GPIO25: TARGET5 (P2_TARGET5.44), MUX_GPIO2 (U3_MUX_GPIO2.15)
GPIO26: TARGET6 (P2_TARGET6.44), MUX_GPIO2 (U3_MUX_GPIO2.14)
GPIO27: TARGET7 (P2_TARGET7.44), MUX_GPIO2 (U3_MUX_GPIO2.13)
GPIO28: TARGET8 (P2_TARGET8.44), MUX_GPIO2 (U3_MUX_GPIO2.12)
GPIO31: TARGET1 (P2_TARGET1.46), MUX_GPIO3 (U3_MUX_GPIO3.4)
GPIO32: TARGET2 (P2_TARGET2.46), MUX_GPIO3 (U3_MUX_GPIO3.3)
GPIO33: TARGET3 (P2_TARGET3.46), MUX_GPIO3 (U3_MUX_GPIO3.2)
GPIO34: TARGET4 (P2_TARGET4.46), MUX_GPIO3 (U3_MUX_GPIO3.1)
GPIO35: TARGET5 (P2_TARGET5.46), MUX_GPIO3 (U3_MUX_GPIO3.15)
GPIO36: TARGET6 (P2_TARGET6.46), MUX_GPIO3 (U3_MUX_GPIO3.14)
GPIO37: TARGET7 (P2_TARGET7.46), MUX_GPIO3 (U3_MUX_GPIO3.13)
GPIO38: TARGET8 (P2_TARGET8.46), MUX_GPIO3 (U3_MUX_GPIO3.12)
GPIO41: TARGET1 (P2_TARGET1.48), MUX_GPIO4 (U3_MUX_GPIO4.4)
GPIO42: TARGET2 (P2_TARGET2.48), MUX_GPIO4 (U3_MUX_GPIO4.3)
GPIO43: TARGET3 (P2_TARGET3.48), MUX_GPIO4 (U3_MUX_GPIO4.2)
GPIO44: TARGET4 (P2_TARGET4.48), MUX_GPIO4 (U3_MUX_GPIO4.1)
GPIO45: TARGET5 (P2_TARGET5.48), MUX_GPIO4 (U3_MUX_GPIO4.15)
GPIO46: TARGET6 (P2_TARGET6.48), MUX_GPIO4 (U3_MUX_GPIO4.14)
GPIO47: TARGET7 (P2_TARGET7.48), MUX_GPIO4 (U3_MUX_GPIO4.13)
GPIO48: TARGET8 (P2_TARGET8.48), MUX_GPIO4 (U3_MUX_GPIO4.12)
GPIO51: TARGET1 (P2_TARGET1.50), MUX_GPIO5 (U3_MUX_GPIO5.4)
GPIO52: TARGET2 (P2_TARGET2.50), MUX_GPIO5 (U3_MUX_GPIO5.3)
GPIO53: TARGET3 (P2_TARGET3.50), MUX_GPIO5 (U3_MUX_GPIO5.2)
GPIO54: TARGET4 (P2_TARGET4.50), MUX_GPIO5 (U3_MUX_GPIO5.1)
GPIO55: TARGET5 (P2_TARGET5.50), MUX_GPIO5 (U3_MUX_GPIO5.15)
GPIO56: TARGET6 (P2_TARGET6.50), MUX_GPIO5 (U3_MUX_GPIO5.14)
GPIO57: TARGET7 (P2_TARGET7.50), MUX_GPIO5 (U3_MUX_GPIO5.13)
GPIO58: TARGET8 (P2_TARGET8.50), MUX_GPIO5 (U3_MUX_GPIO5.12)
GPIO61: TARGET1 (P2_TARGET1.52), MUX_GPIO6 (U3_MUX_GPIO6.4)
GPIO62: TARGET2 (P2_TARGET2.52), MUX_GPIO6 (U3_MUX_GPIO6.3)
GPIO63: TARGET3 (P2_TARGET3.52), MUX_GPIO6 (U3_MUX_GPIO6.2)
GPIO64: TARGET4 (P2_TARGET4.52), MUX_GPIO6 (U3_MUX_GPIO6.1)
GPIO65: TARGET5 (P2_TARGET5.52), MUX_GPIO6 (U3_MUX_GPIO6.15)
GPIO66: TARGET6 (P2_TARGET6.52), MUX_GPIO6 (U3_MUX_GPIO6.14)
GPIO67: TARGET7 (P2_TARGET7.52), MUX_GPIO6 (U3_MUX_GPIO6.13)
GPIO68: TARGET8 (P2_TARGET8.52), MUX_GPIO6 (U3_MUX_GPIO6.12)
GPIO71: TARGET1 (P2_TARGET1.54), MUX_GPIO7 (U3_MUX_GPIO7.4)
GPIO72: TARGET2 (P2_TARGET2.54), MUX_GPIO7 (U3_MUX_GPIO7.3)
GPIO73: TARGET3 (P2_TARGET3.54), MUX_GPIO7 (U3_MUX_GPIO7.2)
GPIO74: TARGET4 (P2_TARGET4.54), MUX_GPIO7 (U3_MUX_GPIO7.1)
GPIO75: TARGET5 (P2_TARGET5.54), MUX_GPIO7 (U3_MUX_GPIO7.15)
GPIO76: TARGET6 (P2_TARGET6.54), MUX_GPIO7 (U3_MUX_GPIO7.14)
GPIO77: TARGET7 (P2_TARGET7.54), MUX_GPIO7 (U3_MUX_GPIO7.13)
GPIO78: TARGET8 (P2_TARGET8.54), MUX_GPIO7 (U3_MUX_GPIO7.12)
JTCK: backplane (P1.B7), MUX_JTCK (U3_MUX_JTCK.5)
JTCK1: TARGET1 (P2_TARGET1.25), MUX_JTCK (U3_MUX_JTCK.4)
JTCK2: TARGET2 (P2_TARGET2.25), MUX_JTCK (U3_MUX_JTCK.3)
JTCK3: TARGET3 (P2_TARGET3.25), MUX_JTCK (U3_MUX_JTCK.2)
JTCK4: TARGET4 (P2_TARGET4.25), MUX_JTCK (U3_MUX_JTCK.1)
JTCK5: TARGET5 (P2_TARGET5.25), MUX_JTCK (U3_MUX_JTCK.15)
JTCK6: TARGET6 (P2_TARGET6.25), MUX_JTCK (U3_MUX_JTCK.14)
JTCK7: TARGET7 (P2_TARGET7.25), MUX_JTCK (U3_MUX_JTCK.13)
JTCK8: TARGET8 (P2_TARGET8.25), MUX_JTCK (U3_MUX_JTCK.12)
JTDI: backplane (P1.B9), MUX_JTDI (U3_MUX_JTDI.5)
JTDI1: TARGET1 (P2_TARGET1.29), MUX_JTDI (U3_MUX_JTDI.4)
JTDI2: TARGET2 (P2_TARGET2.29), MUX_JTDI (U3_MUX_JTDI.3)
JTDI3: TARGET3 (P2_TARGET3.29), MUX_JTDI (U3_MUX_JTDI.2)
JTDI4: TARGET4 (P2_TARGET4.29), MUX_JTDI (U3_MUX_JTDI.1)
JTDI5: TARGET5 (P2_TARGET5.29), MUX_JTDI (U3_MUX_JTDI.15)
JTDI6: TARGET6 (P2_TARGET6.29), MUX_JTDI (U3_MUX_JTDI.14)
JTDI7: TARGET7 (P2_TARGET7.29), MUX_JTDI (U3_MUX_JTDI.13)
JTDI8: TARGET8 (P2_TARGET8.29), MUX_JTDI (U3_MUX_JTDI.12)
JTDO: backplane (P1.B8), MUX_JTDO (U3_MUX_JTDO.5)
JTDO1: TARGET1 (P2_TARGET1.27), MUX_JTDO (U3_MUX_JTDO.4)
JTDO2: TARGET2 (P2_TARGET2.27), MUX_JTDO (U3_MUX_JTDO.3)
JTDO3: TARGET3 (P2_TARGET3.27), MUX_JTDO (U3_MUX_JTDO.2)
JTDO4: TARGET4 (P2_TARGET4.27), MUX_JTDO (U3_MUX_JTDO.1)
JTDO5: TARGET5 (P2_TARGET5.27), MUX_JTDO (U3_MUX_JTDO.15)
JTDO6: TARGET6 (P2_TARGET6.27), MUX_JTDO (U3_MUX_JTDO.14)
JTDO7: TARGET7 (P2_TARGET7.27), MUX_JTDO (U3_MUX_JTDO.13)
JTDO8: TARGET8 (P2_TARGET8.27), MUX_JTDO (U3_MUX_JTDO.12)
JTMS: backplane (P1.B6), MUX_JTMS (U3_MUX_JTMS.5)
JTMS1: TARGET1 (P2_TARGET1.23), MUX_JTMS (U3_MUX_JTMS.4)
JTMS2: TARGET2 (P2_TARGET2.23), MUX_JTMS (U3_MUX_JTMS.3)
JTMS3: TARGET3 (P2_TARGET3.23), MUX_JTMS (U3_MUX_JTMS.2)
JTMS4: TARGET4 (P2_TARGET4.23), MUX_JTMS (U3_MUX_JTMS.1)
JTMS5: TARGET5 (P2_TARGET5.23), MUX_JTMS (U3_MUX_JTMS.15)
JTMS6: TARGET6 (P2_TARGET6.23), MUX_JTMS (U3_MUX_JTMS.14)
JTMS7: TARGET7 (P2_TARGET7.23), MUX_JTMS (U3_MUX_JTMS.13)
JTMS8: TARGET8 (P2_TARGET8.23), MUX_JTMS (U3_MUX_JTMS.12)
MGMT_ADDR: backplane (P1.B2), mgmt (C2.2 R1.1 U2.11)
MGMT_SCL: backplane (P1.B4), mgmt (U2.22), MUX_MGMT_SCL (U3_MUX_MGMT_SCL.5)
MGMT_SCL1: TARGET1 (P2_TARGET1.5), MUX_MGMT_SCL (U3_MUX_MGMT_SCL.4)
MGMT_SCL2: TARGET2 (P2_TARGET2.5), MUX_MGMT_SCL (U3_MUX_MGMT_SCL.3)
MGMT_SCL3: TARGET3 (P2_TARGET3.5), MUX_MGMT_SCL (U3_MUX_MGMT_SCL.2)
MGMT_SCL4: TARGET4 (P2_TARGET4.5), MUX_MGMT_SCL (U3_MUX_MGMT_SCL.1)
MGMT_SCL5: TARGET5 (P2_TARGET5.5), MUX_MGMT_SCL (U3_MUX_MGMT_SCL.15)
MGMT_SCL6: TARGET6 (P2_TARGET6.5), MUX_MGMT_SCL (U3_MUX_MGMT_SCL.14)
MGMT_SCL7: TARGET7 (P2_TARGET7.5), MUX_MGMT_SCL (U3_MUX_MGMT_SCL.13)
MGMT_SCL8: TARGET8 (P2_TARGET8.5), MUX_MGMT_SCL (U3_MUX_MGMT_SCL.12)
MGMT_SDA: backplane (P1.B3), mgmt (U2.23), MUX_MGMT_SDA (U3_MUX_MGMT_SDA.5)
MGMT_SDA1: TARGET1 (P2_TARGET1.7), MUX_MGMT_SDA (U3_MUX_MGMT_SDA.4)
MGMT_SDA2: TARGET2 (P2_TARGET2.7), MUX_MGMT_SDA (U3_MUX_MGMT_SDA.3)
MGMT_SDA3: TARGET3 (P2_TARGET3.7), MUX_MGMT_SDA (U3_MUX_MGMT_SDA.2)
MGMT_SDA4: TARGET4 (P2_TARGET4.7), MUX_MGMT_SDA (U3_MUX_MGMT_SDA.1)
MGMT_SDA5: TARGET5 (P2_TARGET5.7), MUX_MGMT_SDA (U3_MUX_MGMT_SDA.15)
MGMT_SDA6: TARGET6 (P2_TARGET6.7), MUX_MGMT_SDA (U3_MUX_MGMT_SDA.14)
MGMT_SDA7: TARGET7 (P2_TARGET7.7), MUX_MGMT_SDA (U3_MUX_MGMT_SDA.13)
MGMT_SDA8: TARGET8 (P2_TARGET8.7), MUX_MGMT_SDA (U3_MUX_MGMT_SDA.12)
MUX_EN: mgmt (U2.24), MUX_VTREF (U3_MUX_VTREF.7), MUX_JTMS (U3_MUX_JTMS.7), MUX_GPIO0 (U3_MUX_GPIO0.7), MUX_GPIO1 (U3_MUX_GPIO1.7), MUX_GPIO2 (U3_MUX_GPIO2.7), MUX_GPIO3 (U3_MUX_GPIO3.7), MUX_GPIO4 (U3_MUX_GPIO4.7), MUX_GPIO5 (U3_MUX_GPIO5.7), MUX_GPIO6 (U3_MUX_GPIO6.7), MUX_GPIO7 (U3_MUX_GPIO7.7), MUX_TRACECLK (U3_MUX_TRACECLK.7), MUX_TRACED0 (U3_MUX_TRACED0.7), MUX_TRACED1 (U3_MUX_TRACED1.7), MUX_TRACED2 (U3_MUX_TRACED2.7), MUX_TRACED3 (U3_MUX_TRACED3.7), MUX_JTCK (U3_MUX_JTCK.7), MUX_JTDO (U3_MUX_JTDO.7), MUX_JTDI (U3_MUX_JTDI.7), MUX_NRST (U3_MUX_NRST.7), MUX_MGMT_SDA (U3_MUX_MGMT_SDA.7), MUX_MGMT_SCL (U3_MUX_MGMT_SCL.7)
MUX_SEL0: mgmt (U2.25), MUX_VTREF (U3_MUX_VTREF.11), MUX_JTMS (U3_MUX_JTMS.11), MUX_GPIO0 (U3_MUX_GPIO0.11), MUX_GPIO1 (U3_MUX_GPIO1.11), MUX_GPIO2 (U3_MUX_GPIO2.11), MUX_GPIO3 (U3_MUX_GPIO3.11), MUX_GPIO4 (U3_MUX_GPIO4.11), MUX_GPIO5 (U3_MUX_GPIO5.11), MUX_GPIO6 (U3_MUX_GPIO6.11), MUX_GPIO7 (U3_MUX_GPIO7.11), MUX_TRACECLK (U3_MUX_TRACECLK.11), MUX_TRACED0 (U3_MUX_TRACED0.11), MUX_TRACED1 (U3_MUX_TRACED1.11), MUX_TRACED2 (U3_MUX_TRACED2.11), MUX_TRACED3 (U3_MUX_TRACED3.11), MUX_JTCK (U3_MUX_JTCK.11), MUX_JTDO (U3_MUX_JTDO.11), MUX_JTDI (U3_MUX_JTDI.11), MUX_NRST (U3_MUX_NRST.11), mux_usb (P4.6), MUX_MGMT_SDA (U3_MUX_MGMT_SDA.11), MUX_MGMT_SCL (U3_MUX_MGMT_SCL.11)
MUX_SEL1: mgmt (U2.26), MUX_VTREF (U3_MUX_VTREF.10), MUX_JTMS (U3_MUX_JTMS.10), MUX_GPIO0 (U3_MUX_GPIO0.10), MUX_GPIO1 (U3_MUX_GPIO1.10), MUX_GPIO2 (U3_MUX_GPIO2.10), MUX_GPIO3 (U3_MUX_GPIO3.10), MUX_GPIO4 (U3_MUX_GPIO4.10), MUX_GPIO5 (U3_MUX_GPIO5.10), MUX_GPIO6 (U3_MUX_GPIO6.10), MUX_GPIO7 (U3_MUX_GPIO7.10), MUX_TRACECLK (U3_MUX_TRACECLK.10), MUX_TRACED0 (U3_MUX_TRACED0.10), MUX_TRACED1 (U3_MUX_TRACED1.10), MUX_TRACED2 (U3_MUX_TRACED2.10), MUX_TRACED3 (U3_MUX_TRACED3.10), MUX_JTCK (U3_MUX_JTCK.10), MUX_JTDO (U3_MUX_JTDO.10), MUX_JTDI (U3_MUX_JTDI.10), MUX_NRST (U3_MUX_NRST.10), mux_usb (P4.7), MUX_MGMT_SDA (U3_MUX_MGMT_SDA.10), MUX_MGMT_SCL (U3_MUX_MGMT_SCL.10)
MUX_SEL2: mgmt (U2.27), MUX_VTREF (U3_MUX_VTREF.9), MUX_JTMS (U3_MUX_JTMS.9), MUX_GPIO0 (U3_MUX_GPIO0.9), MUX_GPIO1 (U3_MUX_GPIO1.9), MUX_GPIO2 (U3_MUX_GPIO2.9), MUX_GPIO3 (U3_MUX_GPIO3.9), MUX_GPIO4 (U3_MUX_GPIO4.9), MUX_GPIO5 (U3_MUX_GPIO5.9), MUX_GPIO6 (U3_MUX_GPIO6.9), MUX_GPIO7 (U3_MUX_GPIO7.9), MUX_TRACECLK (U3_MUX_TRACECLK.9), MUX_TRACED0 (U3_MUX_TRACED0.9), MUX_TRACED1 (U3_MUX_TRACED1.9), MUX_TRACED2 (U3_MUX_TRACED2.9), MUX_TRACED3 (U3_MUX_TRACED3.9), MUX_JTCK (U3_MUX_JTCK.9), MUX_JTDO (U3_MUX_JTDO.9), MUX_JTDI (U3_MUX_JTDI.9), MUX_NRST (U3_MUX_NRST.9), mux_usb (P4.8), MUX_MGMT_SDA (U3_MUX_MGMT_SDA.9), MUX_MGMT_SCL (U3_MUX_MGMT_SCL.9)
MUX_USB_EN: mgmt (U2.28), mux_usb (P4.3)
NRST: backplane (P1.B10), MUX_NRST (U3_MUX_NRST.5)
NRST1: TARGET1 (P2_TARGET1.31), MUX_NRST (U3_MUX_NRST.4)
NRST2: TARGET2 (P2_TARGET2.31), MUX_NRST (U3_MUX_NRST.3)
NRST3: TARGET3 (P2_TARGET3.31), MUX_NRST (U3_MUX_NRST.2)
NRST4: TARGET4 (P2_TARGET4.31), MUX_NRST (U3_MUX_NRST.1)
NRST5: TARGET5 (P2_TARGET5.31), MUX_NRST (U3_MUX_NRST.15)
NRST6: TARGET6 (P2_TARGET6.31), MUX_NRST (U3_MUX_NRST.14)
NRST7: TARGET7 (P2_TARGET7.31), MUX_NRST (U3_MUX_NRST.13)
NRST8: TARGET8 (P2_TARGET8.31), MUX_NRST (U3_MUX_NRST.12)
PWR_EN1: TARGET1 (U1_TARGET1.4), mgmt (U2.19)
PWR_EN2: TARGET2 (U1_TARGET2.4), mgmt (U2.20)
PWR_EN3: TARGET3 (U1_TARGET3.4), mgmt (U2.21)
PWR_EN4: TARGET4 (U1_TARGET4.4), mgmt (U2.42)
PWR_EN5: TARGET5 (U1_TARGET5.4), mgmt (U2.43)
PWR_EN6: TARGET6 (U1_TARGET6.4), mgmt (U2.44)
PWR_EN7: TARGET7 (U1_TARGET7.4), mgmt (U2.45)
PWR_EN8: TARGET8 (U1_TARGET8.4), mgmt (U2.46)
TRACECLK: backplane (P1.A6), MUX_TRACECLK (U3_MUX_TRACECLK.5)
TRACECLK1: TARGET1 (P2_TARGET1.22), MUX_TRACECLK (U3_MUX_TRACECLK.4)
TRACECLK2: TARGET2 (P2_TARGET2.22), MUX_TRACECLK (U3_MUX_TRACECLK.3)
TRACECLK3: TARGET3 (P2_TARGET3.22), MUX_TRACECLK (U3_MUX_TRACECLK.2)
TRACECLK4: TARGET4 (P2_TARGET4.22), MUX_TRACECLK (U3_MUX_TRACECLK.1)
TRACECLK5: TARGET5 (P2_TARGET5.22), MUX_TRACECLK (U3_MUX_TRACECLK.15)
TRACECLK6: TARGET6 (P2_TARGET6.22), MUX_TRACECLK (U3_MUX_TRACECLK.14)
TRACECLK7: TARGET7 (P2_TARGET7.22), MUX_TRACECLK (U3_MUX_TRACECLK.13)
TRACECLK8: TARGET8 (P2_TARGET8.22), MUX_TRACECLK (U3_MUX_TRACECLK.12)
TRACED0: backplane (P1.A7), MUX_TRACED0 (U3_MUX_TRACED0.5)
TRACED01: TARGET1 (P2_TARGET1.24), MUX_TRACED0 (U3_MUX_TRACED0.4)
TRACED1: backplane (P1.A8), MUX_TRACED1 (U3_MUX_TRACED1.5)
TRACED02: TARGET2 (P2_TARGET2.24), MUX_TRACED0 (U3_MUX_TRACED0.3)
TRACED2: backplane (P1.A9), MUX_TRACED2 (U3_MUX_TRACED2.5)
TRACED03: TARGET3 (P2_TARGET3.24), MUX_TRACED0 (U3_MUX_TRACED0.2)
TRACED3: backplane (P1.A10), MUX_TRACED3 (U3_MUX_TRACED3.5)
TRACED04: TARGET4 (P2_TARGET4.24), MUX_TRACED0 (U3_MUX_TRACED0.1)
TRACED05: TARGET5 (P2_TARGET5.24), MUX_TRACED0 (U3_MUX_TRACED0.15)
TRACED06: TARGET6 (P2_TARGET6.24), MUX_TRACED0 (U3_MUX_TRACED0.14)
TRACED07: TARGET7 (P2_TARGET7.24), MUX_TRACED0 (U3_MUX_TRACED0.13)
TRACED08: TARGET8 (P2_TARGET8.24), MUX_TRACED0 (U3_MUX_TRACED0.12)
TRACED11: TARGET1 (P2_TARGET1.26), MUX_TRACED1 (U3_MUX_TRACED1.4)
TRACED12: TARGET2 (P2_TARGET2.26), MUX_TRACED1 (U3_MUX_TRACED1.3)
TRACED13: TARGET3 (P2_TARGET3.26), MUX_TRACED1 (U3_MUX_TRACED1.2)
TRACED14: TARGET4 (P2_TARGET4.26), MUX_TRACED1 (U3_MUX_TRACED1.1)
TRACED15: TARGET5 (P2_TARGET5.26), MUX_TRACED1 (U3_MUX_TRACED1.15)
TRACED16: TARGET6 (P2_TARGET6.26), MUX_TRACED1 (U3_MUX_TRACED1.14)
TRACED17: TARGET7 (P2_TARGET7.26), MUX_TRACED1 (U3_MUX_TRACED1.13)
TRACED18: TARGET8 (P2_TARGET8.26), MUX_TRACED1 (U3_MUX_TRACED1.12)
TRACED21: TARGET1 (P2_TARGET1.28), MUX_TRACED2 (U3_MUX_TRACED2.4)
TRACED22: TARGET2 (P2_TARGET2.28), MUX_TRACED2 (U3_MUX_TRACED2.3)
TRACED23: TARGET3 (P2_TARGET3.28), MUX_TRACED2 (U3_MUX_TRACED2.2)
TRACED24: TARGET4 (P2_TARGET4.28), MUX_TRACED2 (U3_MUX_TRACED2.1)
TRACED25: TARGET5 (P2_TARGET5.28), MUX_TRACED2 (U3_MUX_TRACED2.15)
TRACED26: TARGET6 (P2_TARGET6.28), MUX_TRACED2 (U3_MUX_TRACED2.14)
TRACED27: TARGET7 (P2_TARGET7.28), MUX_TRACED2 (U3_MUX_TRACED2.13)
TRACED28: TARGET8 (P2_TARGET8.28), MUX_TRACED2 (U3_MUX_TRACED2.12)
TRACED31: TARGET1 (P2_TARGET1.30), MUX_TRACED3 (U3_MUX_TRACED3.4)
TRACED32: TARGET2 (P2_TARGET2.30), MUX_TRACED3 (U3_MUX_TRACED3.3)
TRACED33: TARGET3 (P2_TARGET3.30), MUX_TRACED3 (U3_MUX_TRACED3.2)
TRACED34: TARGET4 (P2_TARGET4.30), MUX_TRACED3 (U3_MUX_TRACED3.1)
TRACED35: TARGET5 (P2_TARGET5.30), MUX_TRACED3 (U3_MUX_TRACED3.15)
TRACED36: TARGET6 (P2_TARGET6.30), MUX_TRACED3 (U3_MUX_TRACED3.14)
TRACED37: TARGET7 (P2_TARGET7.30), MUX_TRACED3 (U3_MUX_TRACED3.13)
TRACED38: TARGET8 (P2_TARGET8.30), MUX_TRACED3 (U3_MUX_TRACED3.12)
USB_D_N: backplane (P1.A4), mux_usb (P4.5)
USB_D_N1: TARGET1 (P2_TARGET1.36), mux_usb (P4.10)
USB_D_N2: TARGET2 (P2_TARGET2.36), mux_usb (P4.13)
USB_D_N3: TARGET3 (P2_TARGET3.36), mux_usb (P4.16)
USB_D_N4: TARGET4 (P2_TARGET4.36), mux_usb (P4.19)
USB_D_N5: TARGET5 (P2_TARGET5.36), mux_usb (P4.22)
USB_D_N6: TARGET6 (P2_TARGET6.36), mux_usb (P4.25)
USB_D_N7: TARGET7 (P2_TARGET7.36), mux_usb (P4.28)
USB_D_N8: TARGET8 (P2_TARGET8.36), mux_usb (P4.31)
USB_D_P: backplane (P1.A3), mux_usb (P4.4)
USB_D_P1: TARGET1 (P2_TARGET1.34), mux_usb (P4.9)
USB_D_P2: TARGET2 (P2_TARGET2.34), mux_usb (P4.12)
USB_D_P3: TARGET3 (P2_TARGET3.34), mux_usb (P4.15)
USB_D_P4: TARGET4 (P2_TARGET4.34), mux_usb (P4.18)
USB_D_P5: TARGET5 (P2_TARGET5.34), mux_usb (P4.23)
USB_D_P6: TARGET6 (P2_TARGET6.34), mux_usb (P4.26)
USB_D_P7: TARGET7 (P2_TARGET7.34), mux_usb (P4.29)
USB_D_P8: TARGET8 (P2_TARGET8.34), mux_usb (P4.32)
VTREF: backplane (P1.A1), MUX_VTREF (U3_MUX_VTREF.5)
VTREF1: TARGET1 (P2_TARGET1.8), MUX_VTREF (U3_MUX_VTREF.4)
VTREF2: TARGET2 (P2_TARGET2.8), MUX_VTREF (U3_MUX_VTREF.3)
VTREF3: TARGET3 (P2_TARGET3.8), MUX_VTREF (U3_MUX_VTREF.2)
VTREF4: TARGET4 (P2_TARGET4.8), MUX_VTREF (U3_MUX_VTREF.1)
VTREF5: TARGET5 (P2_TARGET5.8), MUX_VTREF (U3_MUX_VTREF.15)
VTREF6: TARGET6 (P2_TARGET6.8), MUX_VTREF (U3_MUX_VTREF.14)
VTREF7: TARGET7 (P2_TARGET7.8), MUX_VTREF (U3_MUX_VTREF.13)
VTREF8: TARGET8 (P2_TARGET8.8), MUX_VTREF (U3_MUX_VTREF.12)